# Altium schematic sheet Master Control.SchDoc: Master Control
size A4; SheetNumber: 6; SheetTotal: 5
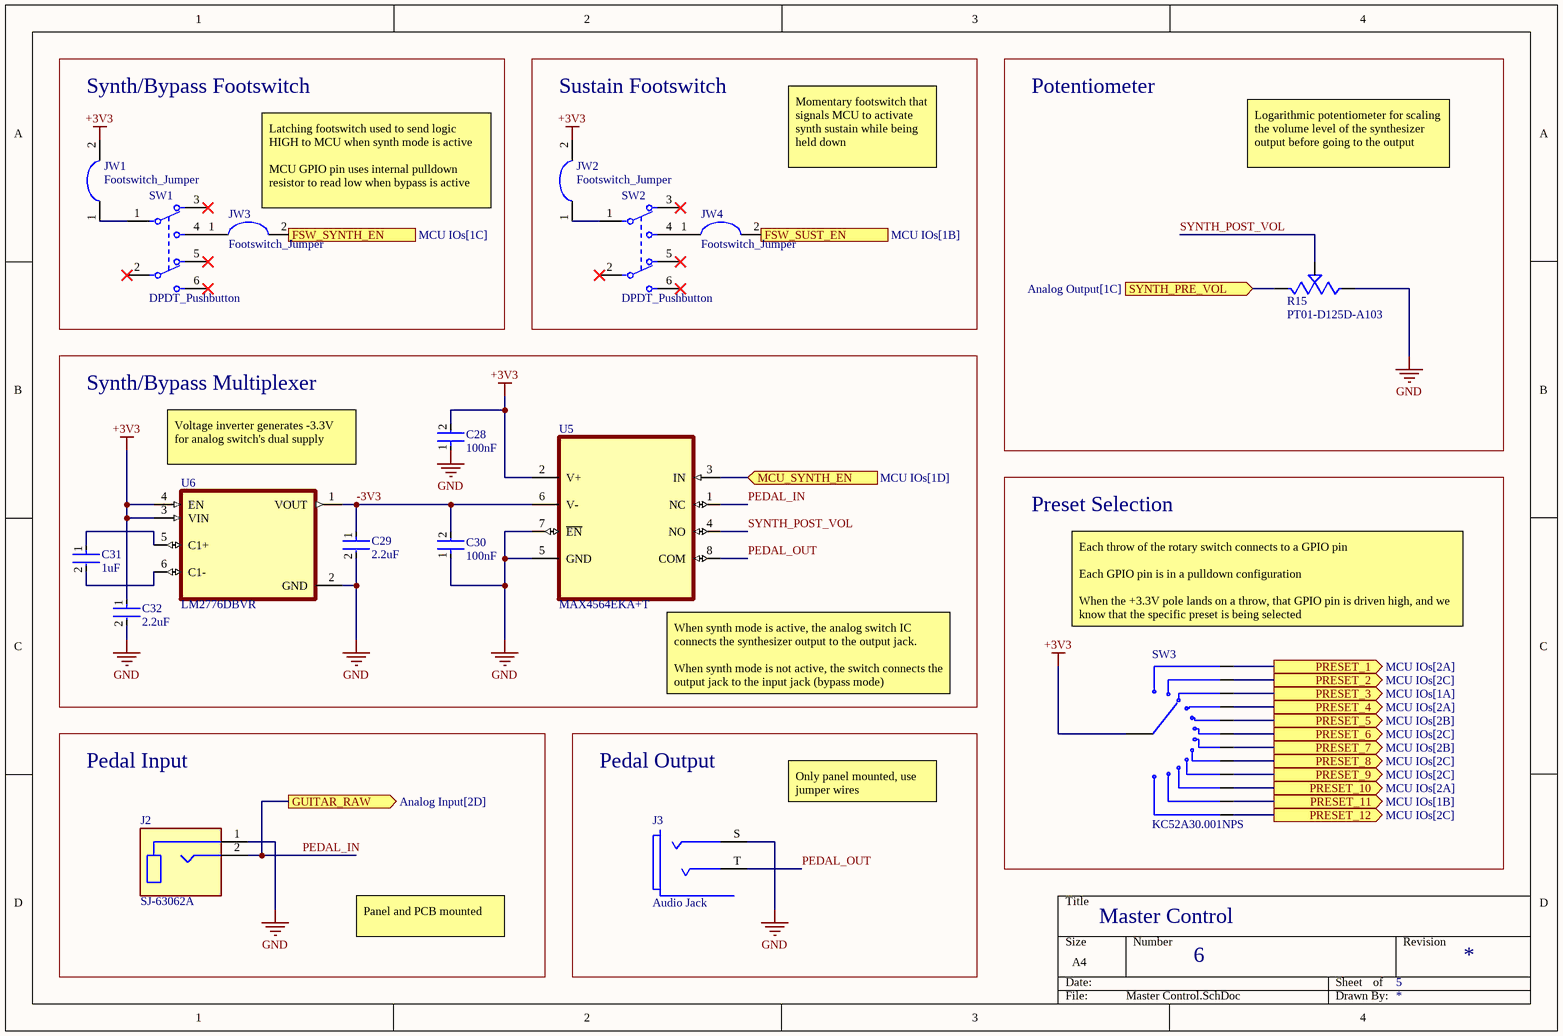
[diagram p0: Master Control.SchDoc]

## Parts
C28  100nF  [FP-CC0603-DA-MFG]
C29  2.2uF  [FP-CC0603-DA-MFG]
C30  100nF  [FP-CC0603-DA-MFG]
C31  1uF  [FP-CC0603-DA-MFG]
C32  2.2uF  [FP-CC0603-DA-MFG]
J2  SJ-63062A  [CUI_SJ-63062A]
J3  Audio Jack  [AudioJack]
JW1  Footswitch_Jumper  [Footswitch_Jumper]
JW2  Footswitch_Jumper  [Footswitch_Jumper]
JW3  Footswitch_Jumper  [Footswitch_Jumper]
JW4  Footswitch_Jumper  [Footswitch_Jumper]
R15  PT01-D125D-A103  [TRIM_PT01-D125D-A103]
SW1  DPDT_Pushbutton  [DPDT_Pushbutton]
SW2  DPDT_Pushbutton  [DPDT_Pushbutton]
SW3  KC52A30.001NPS  [SW_KC52A30.001NPS]
U5  MAX4564EKA+T  [SOT65P280X145-8N]
U6  LM2776DBVR  [SOT95P280X145-6N]

## Blocks framed on the sheet
Synth/Bypass Footswitch: JW1 JW3 SW1
Sustain Footswitch: JW2 JW4 SW2
Potentiometer: R15
Synth/Bypass Multiplexer: C28-C32 U5 U6
Preset Selection: SW3
Pedal Input: J2
Pedal Output: J3

## Ports
FSW_SUST_EN (out, see MCU IOs[1B]), FSW_SYNTH_EN (out, see MCU IOs[1C]), GUITAR_RAW (out, see Analog Input[2D]), MCU_SYNTH_EN (in, see MCU IOs[1D]), PRESET_1 (out, see MCU IOs[2A]), PRESET_2 (out, see MCU IOs[2C]), PRESET_3 (out, see MCU IOs[1A]), PRESET_4 (out, see MCU IOs[2A]), PRESET_5 (out, see MCU IOs[2B]), PRESET_6 (out, see MCU IOs[2C]), PRESET_7 (out, see MCU IOs[2B]), PRESET_8 (out, see MCU IOs[2C]), PRESET_9 (out, see MCU IOs[2C]), PRESET_10 (out, see MCU IOs[2A]), PRESET_11 (out, see MCU IOs[1B]), PRESET_12 (out, see MCU IOs[2C]), SYNTH_PRE_VOL (in, see Analog Output[1C])

## Nets
+3V3: C28.2 C32.1 JW1.2 JW2.2 SW3.A U5.2(V+) U6.3(VIN) U6.4(EN)
GND: C28.1 C29.2 C30.1 C32.2 J2.1(SLEEVE) J3.S R15.3 U5.5(GND) U5.7(~{EN}) U6.2(GND)
-3V3: C29.1 C30.2 U5.6(V-) U6.1(VOUT)
FSW_SUST_EN: JW4.2 ; port FSW_SUST_EN
FSW_SYNTH_EN: JW3.2 ; port FSW_SYNTH_EN
MCU_SYNTH_EN: U5.3(IN) ; port MCU_SYNTH_EN
PEDAL_IN: J2.2(TIP) U5.1(NC) ; port GUITAR_RAW
PEDAL_OUT: J3.T U5.8(COM)
PRESET_1: SW3.1 ; port PRESET_1
PRESET_2: SW3.2 ; port PRESET_2
PRESET_3: SW3.3 ; port PRESET_3
PRESET_4: SW3.4 ; port PRESET_4
PRESET_5: SW3.5 ; port PRESET_5
PRESET_6: SW3.6 ; port PRESET_6
PRESET_7: SW3.7 ; port PRESET_7
PRESET_8: SW3.8 ; port PRESET_8
PRESET_9: SW3.9 ; port PRESET_9
PRESET_10: SW3.10 ; port PRESET_10
PRESET_11: SW3.11 ; port PRESET_11
PRESET_12: SW3.12 ; port PRESET_12
SYNTH_POST_VOL: R15.2 U5.4(NO)
SYNTH_PRE_VOL: R15.1 ; port SYNTH_PRE_VOL
NetC31_1: C31.1 U6.5(C1+)
NetC31_2: C31.2 U6.6(C1-)
NetJW1_1: JW1.1 SW1.1(1_C)
NetJW2_1: JW2.1 SW2.1(1_C)
NetJW3_1: JW3.1 SW1.4(1_NO)
NetJW4_1: JW4.1 SW2.4(1_NO)

Not connected (* = marked no-connect by the designer): SW1 2(2_C)* 3(1_NC)* 5(2_NC)* 6(2_NO)*; SW2 2(2_C)* 3(1_NC)* 5(2_NC)* 6(2_NO)*

## Notes on the sheet
- Momentary footswitch that signals MCU to activate synth sustain while being held down
- Logarithmic potentiometer for scaling the volume level of the synthesizer output before going to the output
- (near JW3) Latching footswitch used to send logic HIGH to MCU when synth mode is active
  MCU GPIO pin uses internal pulldown resistor to read low when bypass is active
- (near U6) Voltage inverter generates -3.3V for analog switch's dual supply
- (near SW3) Each throw of the rotary switch connects to a GPIO pin
  Each GPIO pin is in a pulldown configuration
  When the +3.3V pole lands on a throw, that GPIO pin is driven high, and we know that the specific preset is being selected
- When synth mode is active, the analog switch IC connects the synthesizer output to the output jack.
  When synth mode is not active, the switch connects the output jack to the input jack (bypass mode)
- Only panel mounted, use jumper wires
- Panel and PCB mounted

## Library data of the parts
C28 C30 = CMP-03422-000081-1: CC0603 100 nF X7R 10.00% 25 V; Manufacturer Part Number: CC0603KPX7R8BB104; Manufacturer: YAGEO; Voltage: 25 V; Material: Ceramic; Tolerance: 0.1; Temperature Coefficient: 15%; Package: CC0603-DA; Capacitance: 100 nF; Device Class L2: Capacitors; Temperature Range High: +125°C; Automotive: No; Temperature Range Low: -55°C; Value: 100 nF; Device Class L1: Passive Components; Height: 0.9mm; RoHS: TRUE; Mouser Description: Multilayer Ceramic Capacitors MLCC - SMD/SMT 100nF 25V X7R 10%; Temperature Characteristic: X7R; Footprint Url: http://www.yageo.com/exep/pages/download/literatures/UPY-C_GEN_24.pdf; Octopart: https://octopart.com/cc0603kpx7r8bb104-yageo-12885111; Category: Cap; ComponentLink2Description: Datasheet; Voltage Rating: 25 V; Temperature: -55°C to +125°C; Device Class L3: Ceramic Capacitors; ComponentLink2URL: http://www.yageo.com/documents/recent/UPY-GPHC_X7R_6.3V-to-50V_18.pdf; Lead Free: Yes
C29 C32 = CMP-03422-001238-1: CAP CER 2.2UF 16V X7R 0603; Manufacturer: YAGEO; Manufacturer Part Number: CC0603KRX7R7BB225; Temperature Coefficient: 15%; Material: Ceramic; Tolerance: 0.1; Voltage: 16 V; Temperature Range High: +125°C; Digikey Description: CAP CER 2.2UF 16V X7R 0603; Temperature: -55°C to +125°C; Value: 2.2 uF; Lead Free: Yes; Capacitance: 2.2 uF; Package: CC0603-DA; ComponentLink2URL: http://www.yageo.com/documents/recent/UPY-GPHC_X7R_6.3V-to-50V_18.pdf; Device Class L1: Passive Components; Category: Cap; ComponentLink2Description: Datasheet; Mouser Description: Cap Ceramic 2.2uF 16V X7R 10% Pad SMD 0603 125C Automotive T/R; Device Class L2: Capacitors; RoHS: TRUE; Automotive: No; Voltage Rating: 16 V; Device Class L3: Ceramic Capacitors; Temperature Range Low: -55°C; Height: 0.9mm; Footprint Url: http://www.yageo.com/exep/pages/download/literatures/UPY-C_GEN_24.pdf; Temperature Characteristic: X7R; Octopart: https://octopart.com/cc0603krx7r7bb225-yageo-67146440
C31 = CMP-2100-03598-2: CAP CER 1UF 25V X7R 0603; Manufacturer Part Number: CC0603KRX7R8BB105; Manufacturer: YAGEO; Tolerance: 0.1; Temperature Coefficient: 15%; Material: Ceramic; Value: 1 uF; ComponentLink2URL: http://www.yageo.com/documents/recent/UPY-GPHC_X7R_6.3V-to-50V_18.pdf; Temperature Range Low: -55°C; Temperature Range High: +125°C; Device Class L3: Ceramic Capacitors; Voltage: 25 V; Voltage Rating: 25 V; Capacitance: 1 uF; Mouser Description: 0603 1 uF 25 V ±10% Tolerance X7R SMT Multilayer Ceramic Capacitor; Footprint Url: http://www.yageo.com/exep/pages/download/literatures/UPY-C_GEN_24.pdf; Height: 0.9mm; Digikey Description: CAP CER 1UF 25V X7R 0603; Temperature: -55°C to +125°C; ComponentLink2Description: Datasheet; Device Class L2: Capacitors; Category: Cap; Lead Free: Yes; Octopart: https://octopart.com/cc0603krx7r8bb105-yageo-24490981; RoHS: TRUE; Package: CC0603-DA; Device Class L1: Passive Components; Temperature Characteristic: X7R; Automotive: No
J2 = SJ-63062A: 6.35 mm, Mono, Right Angle, Through Hole, 2 Conductors, 0 Internal Switches, Audio Jack Connector; MF: Same Sky; SnapEDA_Link: https://www.snapeda.com/parts/SJ-63062A/Same+Sky/view-part/?ref=snap; Package: None; Value: *; MP: SJ-63062A; Check_prices: https://www.snapeda.com/parts/SJ-63062A/Same+Sky/view-part/?ref=eda
J3 = Audio Jack: PJ-629HAN-05
R15 = PT01-D125D-A103: 10 mm, Vertical, Logarithmic, 10 kÎ©, Through Hole, D-cut Rotary Potentiometer; MF: Same Sky; SnapEDA_Link: https://www.snapeda.com/parts/PT01-D125D-A103/Same+Sky/view-part/?ref=snap; Package: None; Value: *; MP: PT01-D125D-A103; Check_prices: https://www.snapeda.com/parts/PT01-D125D-A103/Same+Sky/view-part/?ref=eda
SW1 = DPDT_Pushbutton: ST61L-P
SW2 = DPDT_Pushbutton: PBS24212P
SW3 = KC52A30.001NPS: Rotary Switch 12 Position SP12T 350mA (AC) 125 VAC Panel Mount, Through Hole; MF: E-Switch; Availability: In Stock; SnapEDA_Link: https://www.snapeda.com/parts/KC52A30.001NPS/E-Switch/view-part/?ref=snap; Check_prices: https://www.snapeda.com/parts/KC52A30.001NPS/E-Switch/view-part/?ref=eda; Price: None; Package: None; Purchase-URL: https://pricing.snapeda.com/search/part/KC52A30.001NPS/?ref=eda; MP: KC52A30.001NPS; Value: *
U5 = MAX4564EKA+T: Low-Voltage, Dual-Supply, SPDT Analog Switch with Enable; MF: Analog Devices; SnapEDA_Link: https://www.snapeda.com/parts/MAX4564EKA+T/Analog+Devices/view-part/?ref=snap; Package: SOT-8 Maxim; Value: *; MP: MAX4564EKA+T; Check_prices: https://www.snapeda.com/parts/MAX4564EKA+T/Analog+Devices/view-part/?ref=eda
U6 = LM2776DBVR: Switched Capacitor Inverter; MF: Texas Instruments; SnapEDA_Link: https://www.snapeda.com/parts/LM2776DBVR/Texas+Instruments/view-part/?ref=snap; Package: SOT-23-6 Texas Instruments; Value: *; MP: LM2776DBVR; Check_prices: https://www.snapeda.com/parts/LM2776DBVR/Texas+Instruments/view-part/?ref=eda